# EAGLE design wifi_62mil (EAGLE 5.11)
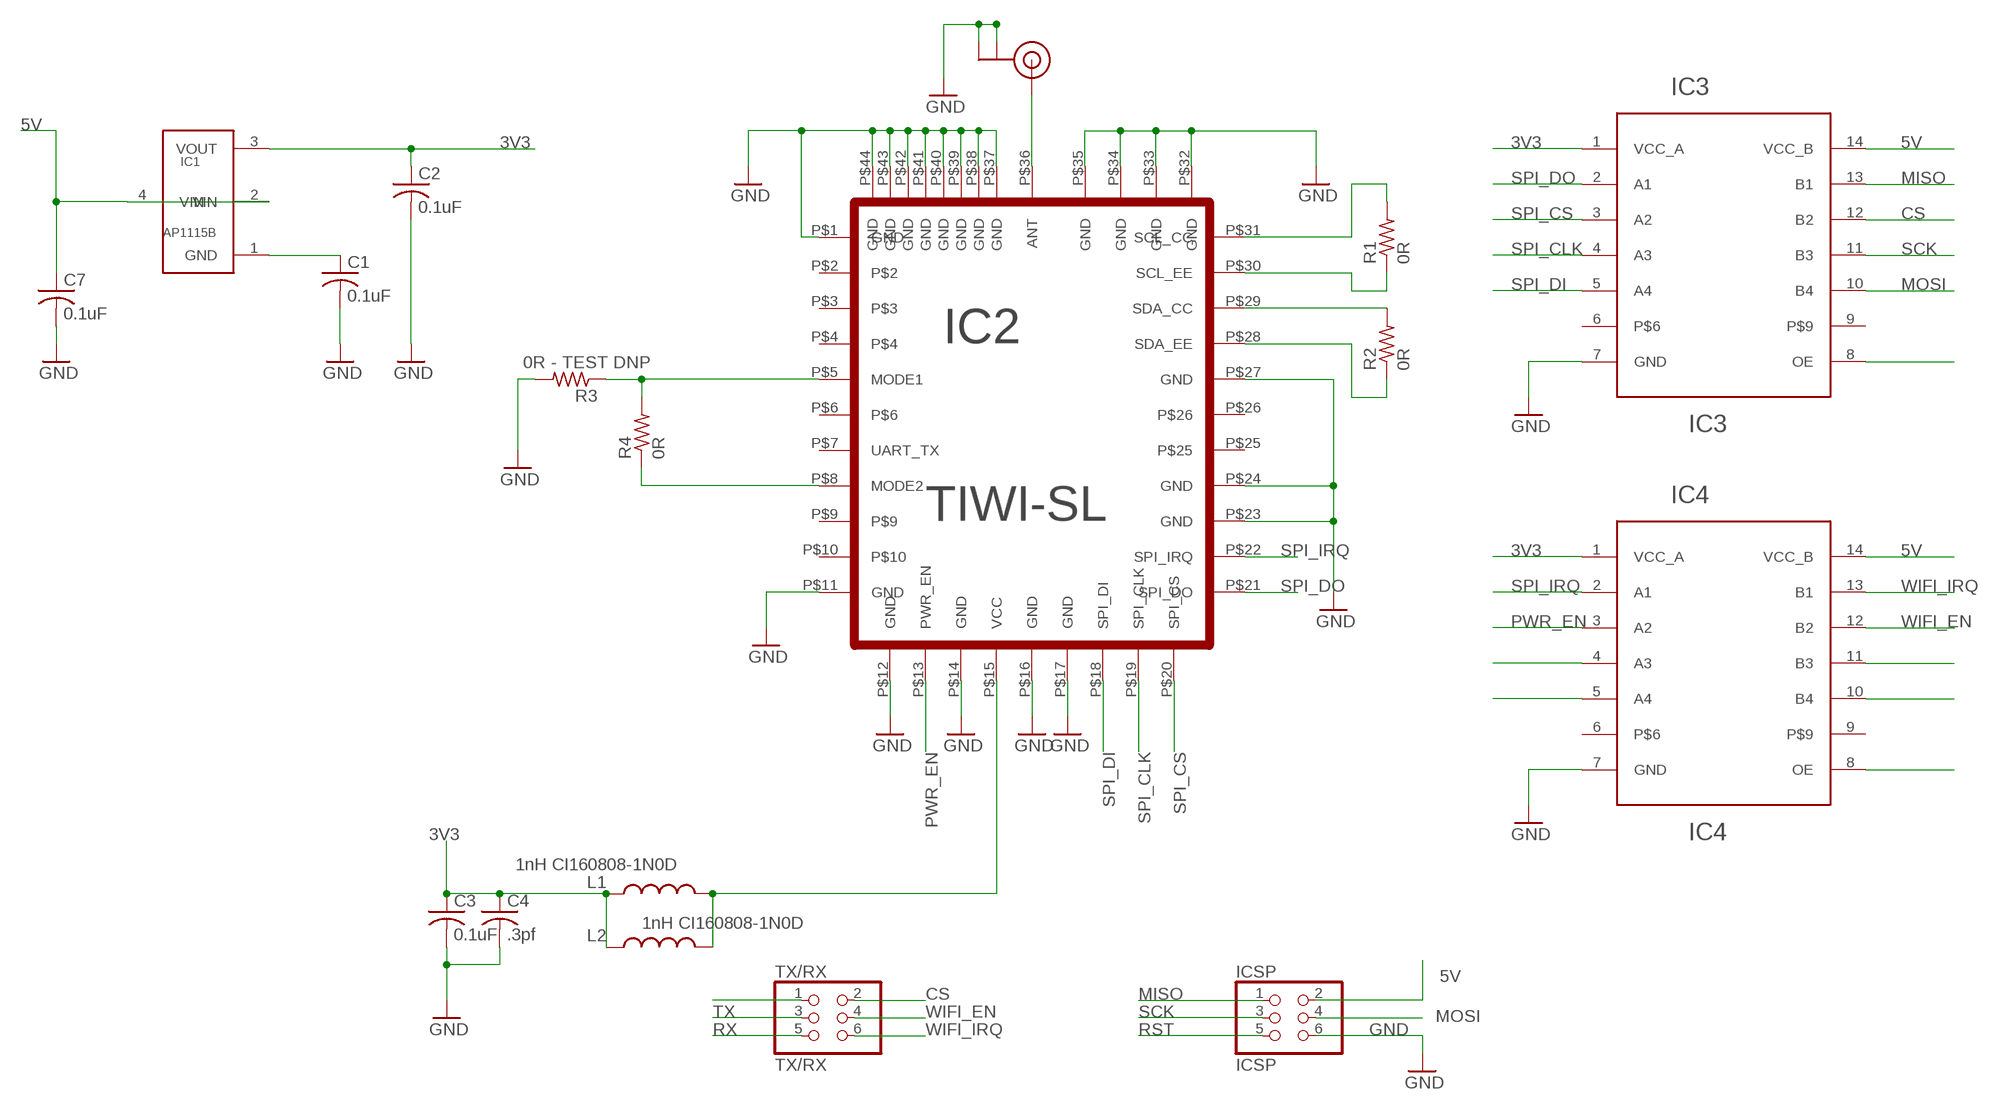
[diagram p0: schematic, sheet 1]

## Parts
ANT  U.FL  [U.FL]
C1  0.1uF  C-USC0603  [C0603]
C2  0.1uF  C-USC0603  [C0603]
C3  0.1uF  C-USC0603  [C0603]
C4  .3pf  C-USC0603  [C0603]
C7  0.1uF  C-USC0603  [C0603]
IC1  AP1115B  AP1115  [SOT89-3L]
IC2  TIWI-SL  [TIWI-SL]
IC3  TXS0104EPWR  TXS0104E  [TSSOP-14]
IC4  TXS0104EPWR  TXS0104E  [TSSOP-14]
ICSP  ICSP  PINHD-2X3  [2X03]
L1  1nH CI160808-1N0D  INDUCTOR0603  [0603]
L2  1nH CI160808-1N0D  INDUCTOR0603  [0603]
R1  0R  R-US_R0603  [R0603]
R2  0R  R-US_R0603  [R0603]
R3  0R - TEST DNP  R-US_R0603  [R0603]
R4  0R  R-US_R0603  [R0603]
TX/RX  TX/RX  PINHD-2X3  [2X03]

## Nets
3V3 [power]: C2.1 C3.1 C4.1 IC1.3(VOUT) IC3.1(VCC_A) IC4.1(VCC_A) L1.1 L2.1
5V [power]: C7.1 IC1.2(VIN) IC1.4(VIN) IC3.14(VCC_B) IC4.14(VCC_B) ICSP.2
CS: IC3.12(B2) TX/RX.2
GND: ANT.P$1(GND) ANT.P$2(GND) C1.2 C2.2 C3.2 C4.2 C7.2 IC2.P$1(GND) IC2.P$11(GND) IC2.P$12(GND) IC2.P$14(GND) IC2.P$16(GND) IC2.P$17(GND) IC2.P$23(GND) IC2.P$24(GND) IC2.P$27(GND) IC2.P$32(GND) IC2.P$33(GND) IC2.P$34(GND) IC2.P$35(GND) IC2.P$37(GND) IC2.P$38(GND) IC2.P$39(GND) IC2.P$40(GND) IC2.P$41(GND) IC2.P$42(GND) IC2.P$43(GND) IC2.P$44(GND) IC3.7(GND) IC4.7(GND) ICSP.6 R3.2
MISO: IC3.13(B1) ICSP.1
MOSI: IC3.10(B4) ICSP.4
N$1: TX/RX.1
N$2: C1.1 IC1.1(GND)
N$3: ANT.P$3(SIGNAL) IC2.P$36(ANT)
N$96: IC2.P$5(MODE1) R3.1 R4.2
N$97: IC2.P$8(MODE2) R4.1
N$98: IC2.P$31(SCL_CC) R1.2
N$99: IC2.P$30(SCL_EE) R1.1
N$100: IC2.P$29(SDA_CC) R2.2
N$101: IC2.P$28(SDA_EE) R2.1
N$102: IC2.P$15(VCC) L1.2 L2.2
N$117: IC3.8(OE)
N$120: IC4.4(A3)
N$121: IC4.5(A4)
N$124: IC4.11(B3)
N$125: IC4.10(B4)
N$126: IC4.8(OE)
PWR_EN: IC2.P$13(PWR_EN) IC4.3(A2)
RST: ICSP.5
RX: TX/RX.5
SCK: IC3.11(B3) ICSP.3
SPI_CLK: IC2.P$19(SPI_CLK) IC3.4(A3)
SPI_CS: IC2.P$20(SPI_CS) IC3.3(A2)
SPI_DI: IC2.P$18(SPI_DI) IC3.5(A4)
SPI_DO: IC2.P$21(SPI_DO) IC3.2(A1)
SPI_IRQ: IC2.P$22(SPI_IRQ) IC4.2(A1)
TX: TX/RX.3
WIFI_EN: IC4.12(B2) TX/RX.4
WIFI_IRQ: IC4.13(B1) TX/RX.6
Unconnected: IC2.P$2 IC2.P$3 IC2.P$4 IC2.P$6 IC2.P$7(UART_TX) IC2.P$9 IC2.P$10 IC2.P$25 IC2.P$26 IC3.6 IC3.9 IC4.6 IC4.9

## Library data of the parts
ANT = SparkFun:U.FL
C1-C4 C7 = rcl:C-US: CAPACITOR, American symbol
IC1 = wifi:AP1115
IC2 = pcbqr_v3:TIWI-SL
IC3 IC4 = pcbqr_v3:TXS0104E
ICSP TX/RX = pinhead:PINHD-2X3: PIN HEADER
L1 L2 = SparkFun:INDUCTOR: Inductors Basic Inductor/Choke - 0603 and 1206. Footprints are not proven and vary greatly between part numbers.
R1-R4 = pcbqr_v3:R-US_: RESISTOR, American symbol

## Net classes
0 default: width 0.203 mm, drill 0.356 mm, clearance 0.203 mm
1 power: width 0.203 mm

## Board
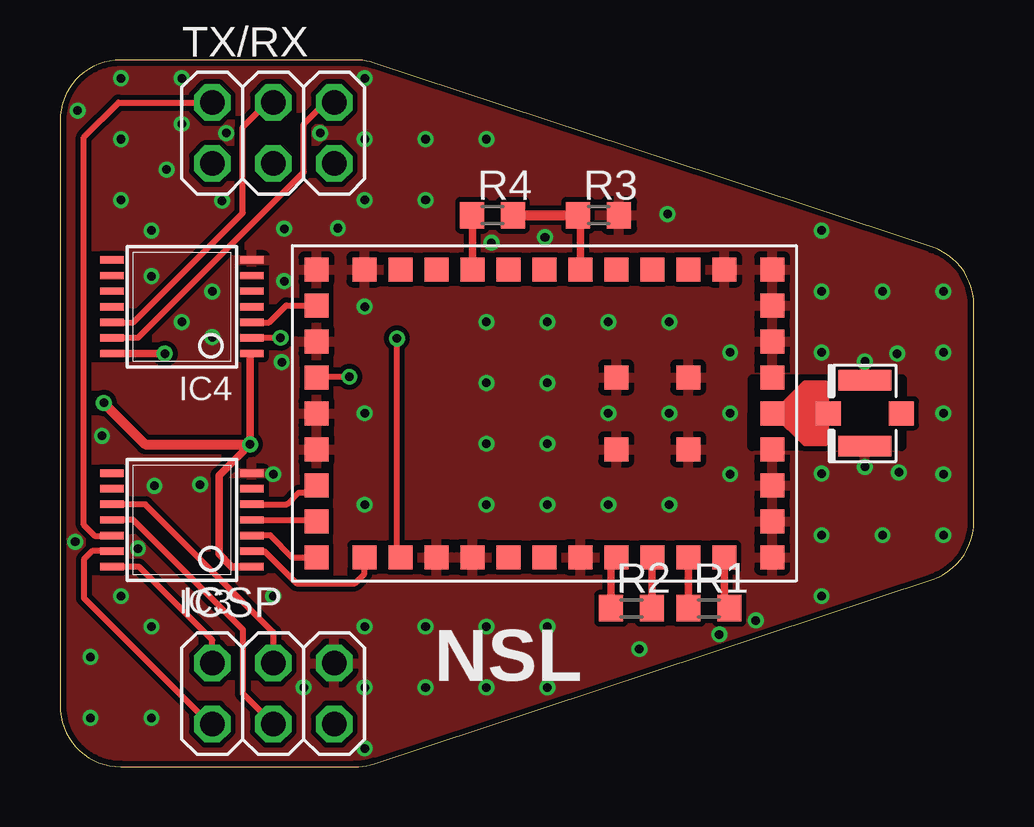
[diagram p1: board, top side]
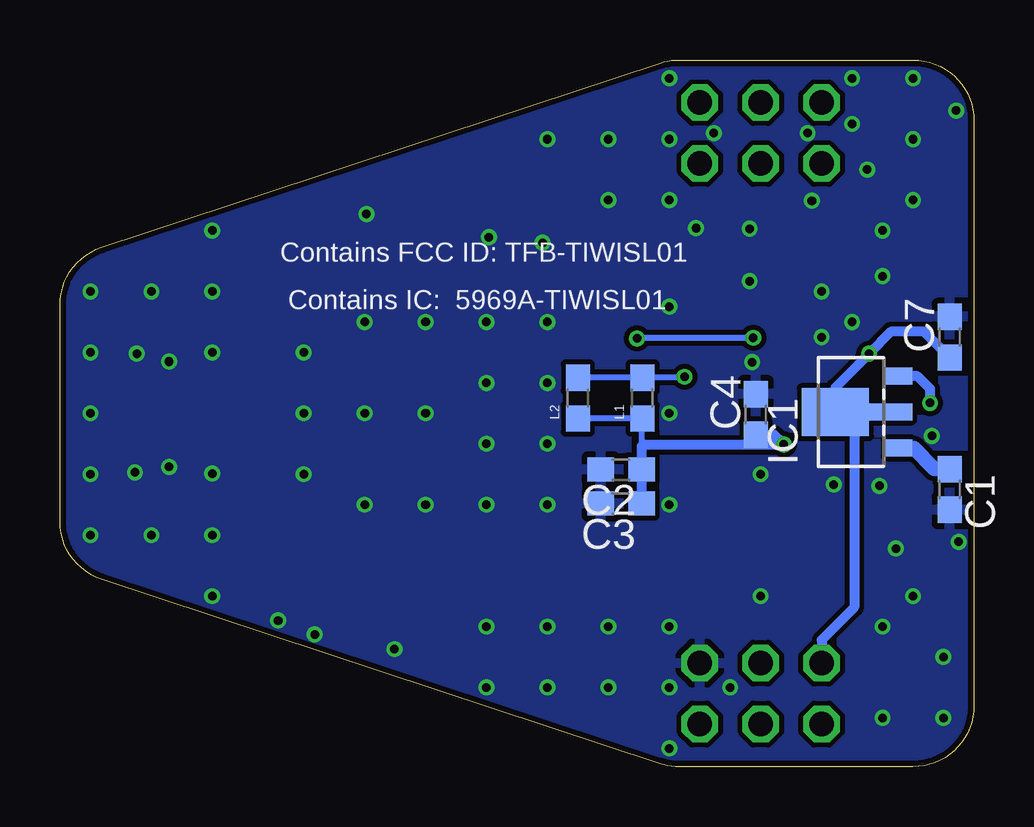
[diagram p2: board, bottom side, seen from below]

Size 38.1 x 29.46 mm. Coordinates in mm from the lower left corner, seen from the top.
Outline: 13.09,29.34 arc18 12.29,29.46 2.54,29.46 arc90 0,26.92 0,2.54 arc90 2.54,0 12.29,0 arc18 13.09,0.13 36.36,7.81 arc72 38.1,10.22 38.1,19.24 arc72 36.36,21.66 13.09,29.34
Copper layers (1*16): Top 0.035mm / dielectric 1.5mm / Bottom 0.035mm
Design rules "ITead_rule *": minimum track width 6mil, minimum drill 12mil, track to track 6mil, track to pad 6mil, pad to pad 6mil, via to via 6mil, smd to smd 0mil, copper to edge 10mil, drill to drill 10mil, minimum pad ring 10mil, minimum via ring 6mil, stop-mask expansion 2mil, vias tented up to drill 14mil, thermal gap 10mil
tRestrict: area 28.9,13.4 to 35.1,16.2

### Footprints (pad centres in the part's own frame; a part is rotated, then mirrored left to right if it is on the bottom)
U.FL = smd 2.2 x 0.85: P$1 0,1.375; P$2 0,-1.375 | smd 1.05 x 1: P$3 1.525,0; P$4 -1.525,0
C0603 = smd 1.1 x 1: 1 -0.85,0; 2 0.85,0
SOT89-3L = smd 0.7 x 1.1: 1 -1.5,-1.75; 3 1.5,-1.75 | smd 0.7 x 1.8: 2 0,-1.4 | smd 2 x 2.8: 4 0,0.9
TIWI-SL = smd 1 x 1: P$1 -6,7.5; P$2 -6,6; P$3 -6,4.5; P$4 -6,3; P$5 -6,1.5; P$6 -6,0; P$7 -6,-1.5; P$8 -6,-3; P$9 -6,-4.5; P$10 -6,-6; P$11 -6,-7.5; P$12 -6,-9.5; P$13 -4.5,-9.5; P$14 -3,-9.5; P$15 -1.5,-9.5; P$16 0,-9.5; P$17 1.5,-9.5; P$18 3,-9.5; P$19 4.5,-9.5; P$20 6,-9.5; P$21 6,-7.5; P$22 6,-6; P$23 6,-4.5; P$24 6,-3; P$25 6,-1.5; P$26 6,0; P$27 6,1.5; P$28 6,3; P$29 6,4.5; P$30 6,6; P$31 6,7.5; P$32 6,9.5; P$33 4.5,9.5; P$34 3,9.5; P$35 1.5,9.5; P$36 0,9.5; P$37 -1.5,9.5; P$38 -3,9.5; P$39 -4.5,9.5; P$40 -6,9.5; P$41 -1.5,6; P$42 1.5,6; P$43 -1.5,3; P$44 1.5,3
TSSOP-14 = smd 0.305 x 0.991: 1 -1.95,-2.918; 2 -1.3,-2.918; 3 -0.65,-2.918; 4 0,-2.918; 5 0.65,-2.918; 6 1.3,-2.918; 7 1.95,-2.918; 8 1.95,2.918; 9 1.3,2.918; 10 0.65,2.918; 11 0,2.918; 12 -0.65,2.918; 13 -1.3,2.918; 14 -1.95,2.918
2X03 = drill 1.016 octagon: 1 -2.54,-1.27; 2 -2.54,1.27; 3 0,-1.27; 4 0,1.27; 5 2.54,-1.27; 6 2.54,1.27
0603 = smd 1.1 x 1: 1 -0.85,0; 2 0.85,0
R0603 = smd 1 x 1.1: 1 -0.85,0; 2 0.85,0

### Placement (x,y rotation side)
ANT  33.55,14.73 180 top
C1  1.02,11.56 270 bottom
C2  14.71,12.4 180 bottom
C3  14.71,10.97 180 bottom
C4  9.09,14.68 90 bottom
C7  1.02,17.91 90 bottom
IC1  4.88,14.78 90 bottom
IC2  20.19,14.73 270 top
IC3  5.08,10.29 90 top
IC4  5.08,19.18 90 top
ICSP  8.89,3.05 0 top
L1  13.82,15.37 90 bottom
L2  16.51,15.37 90 bottom
R1  27.05,6.6 0 top
R2  23.83,6.6 0 top
R3  22.45,22.99 0 top
R4  18.03,22.99 0 top
TX/RX  8.89,26.42 0 top

### Tracks (layer width: path | path; a pad name or v marks a point on that pad's centre or on a via)
3V3  (via drill 0.36)
  Top 0.305: IC3.1 7.16,8.34 6.63,8.86 6.63,12.14 v7.92,13.44 7.92,17.15 IC4.1
  Top 0.406: v1.83,15.16 3.56,13.44 v7.92,13.44
  Bottom 0.254: L2.1 L1.1 13.83,14.5 13.83,13.44 arc-90 13.81,13.41
  Bottom 0.305: v7.92,13.44 8.02,13.53
  Bottom 0.406: 8.02,13.53 8.32,13.83 C4.1 | 7.92,13.56 v7.92,13.44 7.95,13.41 13.81,13.41 13.86,13.36 C2.1 C3.1 | IC1.3 2.36,16.28 1.83,15.75 v1.83,15.16
5V  (via drill 0.36)
  Top 0.254: IC3.14 3.3,8.34 6.35,5.28 ICSP.2
  Top 0.305: IC4.14 v4.36,17.23 v4.37,17.22
  Bottom 0.254: IC1.4 IC1.2
  Bottom 0.305: v4.37,17.22 4.32,17.27
  Bottom 0.406: C7.1 2.1,18.14 3.45,18.14 v4.37,17.22 5.78,15.81 IC1.4 4.99,14 4.99,6.64 6.35,5.28 ICSP.2
CS
  Top 0.254: IC3.12 1.45,9.63 0.99,10.08 0.99,26.24 2.44,27.69 TX/RX.2
GND  (via drill 0.36)
  Top 0.305: ANT.P$2 v33.55,16.89
  other vias: 31.75,22.35 31.75,19.81 34.29,19.81 36.83,19.81 36.83,17.27 34.9,17.22 31.75,17.27 31.75,12.22 34.98,12.27 36.83,12.19 36.83,9.65 34.29,9.65 31.75,9.65 31.75,7.11 36.83,14.73 27.94,14.73 25.4,14.73 27.94,17.27 25.4,18.54 25.4,10.92 27.94,12.19 22.86,18.54 20.32,18.54 20.32,16 20.32,13.46 20.32,10.92 22.86,10.92 22.86,14.73 17.78,18.54 17.78,16 17.78,13.46 17.78,10.92 17.78,26.16 15.24,26.16 15.24,23.62 12.7,26.16 12.7,23.62 20.32,5.84 20.32,3.3 17.78,5.84 15.24,5.84 12.7,5.84 17.78,3.3 15.24,3.3 12.7,3.3 12.7,0.76 12.7,28.7 8.89,7.11 2.54,7.11 3.81,5.84 3.81,2.03 1.27,2.03 1.27,4.57 10.16,3.3 8.89,12.19 9.25,16.87 12.7,14.73 12.7,10.92 12.7,19.18 2.54,26.16 2.54,23.62 4.45,24.89 5.08,26.8 5.08,28.7 2.54,28.7 0.74,27.36 6.35,19.81 6.35,17.91 5.08,18.54 3.81,20.45 3.81,22.35 5.84,11.76 3.94,11.71 3.25,9.09 10.85,26.42 6.93,26.42 20.22,22.07 17.98,21.84 25.32,23.04 0.64,9.37 6.76,23.6 29.01,6.1 24.16,4.9 27.48,5.51 9.35,20.24 9.35,22.43 11.58,22.45 1.75,13.79 33.55,12.5
  pour Top: -0.81,30.18 38.33,30.78 38.63,-0.99 -0.51,-1.6
  pour Bottom: -0.86,30.81 38.53,30.89 38.53,-0.99 -0.86,-1.07
MISO
  Top 0.254: IC3.13 1.34,8.99 0.99,8.64 0.99,7.04 6.25,1.78 ICSP.1
MOSI
  Top 0.254: IC3.10 3.56,10.94 8.89,5.6 ICSP.4
N$2
  Bottom 0.61: 3.1,13.26 IC1.1 2.51,13.28 1.65,12.42 C1.1
N$3
  Top 0.305: IC2.P$36 29.84,14.73 | 29.84,14.73 31.06,15.95 | 31.06,15.95 31.06,15.93 | 31.06,13.51 31.06,15.93 | 29.84,14.73 31.06,13.51 | 29.84,14.73 31.9,14.73 31.9,15.95 31.06,15.95 | 31.06,15.95 31.06,15.93 | 31.06,13.51 31.06,15.93 | 31.06,13.51 31.9,13.51 31.9,14.22 30.35,14.22 30.35,14.96 30.4,14.96 30.89,15.44 30.89,13.99 30.89,14.1 30.53,14.45 30.53,14.88 30.61,14.96 30.61,14.6 30.71,14.5 30.71,15.14 31.27,15.7 31.67,15.7 31.67,13.74 31.32,13.74 31.32,15.42 31.34,15.44 31.47,15.44 31.5,15.47 31.5,13.94 31.5,14.2 ANT.P$3
N$96
  Top 0.305: R3.1 21.69,22.9 IC2.P$5
  Top 0.406: R4.2 R3.1
N$97
  Top 0.305: R4.1 17.19,22.98 IC2.P$8
N$98
  Top 0.305: R1.2 27.69,6.68 IC2.P$31
N$99
  Top 0.305: IC2.P$30 26.2,8.72 R1.1
N$100
  Top 0.305: IC2.P$29 24.68,8.71 R2.2
N$101
  Top 0.305: IC2.P$28 22.98,8.51 R2.1
N$102  (via drill 0.36)
  Top 0.254: IC2.P$15 10.72,16.26 v12.06,16.26
  Bottom 0.254: L2.2 L1.2 12.1,16.22 v12.06,16.26
PWR_EN
  Top 0.254: IC4.3 8.01,18.52 8.71,18.52 9.43,19.23 IC2.P$13
SCK
  Top 0.254: ICSP.3 7.62,3.05 7.62,5.71 3.05,10.29 IC3.11
SPI_CLK
  Top 0.254: IC2.P$19 10.64,10.29 IC3.4
SPI_CS
  Top 0.254: IC3.3 8.03,9.65 8.76,9.65 9.68,8.73 IC2.P$20
SPI_DI
  Top 0.254: IC2.P$18 10.39,11.43 9.96,11.43 9.46,10.94 IC3.5
SPI_DO
  Top 0.254: IC3.2 8.51,8.99 9.86,7.64 12.29,7.64 12.69,8.04 IC2.P$21
SPI_IRQ  (via drill 0.36)
  Top 0.254: IC2.P$22 14.05,8.88 v14.05,17.86 | v9.2,17.88 v9.19,17.88 IC4.2
  Bottom 0.254: v14.05,17.86 14.02,17.88 v9.2,17.88
WIFI_EN
  Top 0.254: IC4.12 2.17,18.52 3.05,18.52 7.62,23.09 7.62,26.67 8.64,27.69 TX/RX.4
WIFI_IRQ
  Top 0.254: IC4.13 3.25,17.88 10.16,24.79 10.16,26.8 11.05,27.69 TX/RX.6

### Text on the board
tPlace: NSL
bPlace: Contains FCC ID: TFB-TIWISL01 | Contains IC: 5969A-TIWISL01